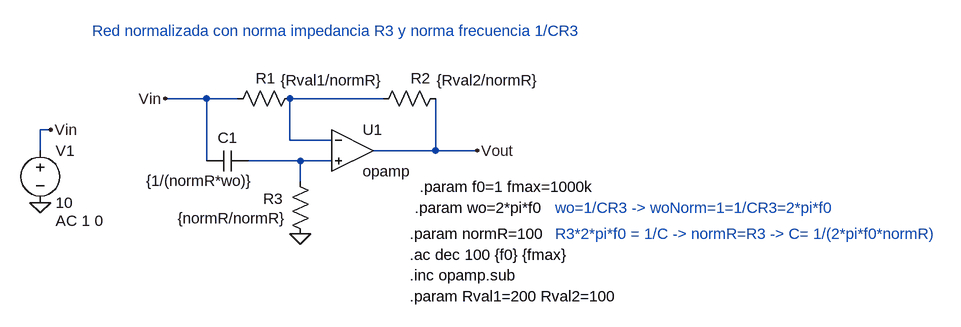
[diagram p0: schematic simulacion.asc]
simulacion.asc, the LTspice schematic file:
Version 4
SHEET 1 1152 680
WIRE 16 64 -48 64
WIRE 64 64 16 64
WIRE 288 64 144 64
WIRE -224 112 -240 112
WIRE 144 128 144 64
WIRE 208 128 144 128
WIRE -240 144 -240 112
WIRE 368 144 368 64
WIRE 368 144 272 144
WIRE 432 144 368 144
WIRE 16 160 16 64
WIRE 160 160 80 160
WIRE 208 160 160 160
WIRE 160 192 160 160
FLAG 160 272 0
FLAG -48 64 Vin
FLAG 432 144 Vout
FLAG -240 224 0
FLAG -224 112 Vin
SYMBOL OpAmps\\opamp 240 80 R0
SYMATTR InstName U1
SYMBOL res 160 48 R90
WINDOW 0 0 53 VBottom 2
WINDOW 3 -28 -49 VTop 2
SYMATTR InstName R1
SYMATTR Value {Rval1/normR}
SYMBOL res 384 48 R90
WINDOW 0 0 39 VBottom 2
WINDOW 3 -28 -65 VTop 2
SYMATTR InstName R2
SYMATTR Value {Rval2/normR}
SYMBOL res 176 288 R180
WINDOW 0 42 70 Left 2
WINDOW 3 36 40 Left 2
SYMATTR InstName R3
SYMATTR Value {normR/normR}
SYMBOL cap 80 144 R90
WINDOW 0 -4 32 VBottom 2
WINDOW 3 31 74 VTop 2
SYMATTR InstName C1
SYMATTR Value {1/(normR*wo)}
SYMBOL voltage -240 128 R0
WINDOW 123 24 124 Left 2
WINDOW 39 0 0 Left 0
SYMATTR InstName V1
SYMATTR Value 10
SYMATTR Value2 AC 1 0
TEXT -160 -40 Left 2 ;Red normalizada con norma impedancia R3 y norma frecuencia 1/CR3
TEXT 328 272 Left 2 !.param normR=100
TEXT 328 304 Left 2 !.ac dec 100 {f0} {fmax}
TEXT 328 336 Left 2 !.inc opamp.sub
TEXT 336 232 Left 2 !.param wo=2*pi*f0
TEXT 552 232 Left 2 ;wo=1/CR3 -> woNorm=1=1/CR3=2*pi*f0
TEXT 552 272 Left 2 ;R3*2*pi*f0 = 1/C -> normR=R3 -> C= 1/(2*pi*f0*normR)
TEXT 344 200 Left 2 !.param f0=1 fmax=1000k
TEXT 328 368 Left 2 !.param Rval1=200 Rval2=100

The netlist it stands for:
* simulacion.asc
XU1 N001 N002 Vout opamp Aol=100K GBW=10Meg  ; pins invin noninvin out
R1 N001 Vin {Rval1/normR}
R2 Vout N001 {Rval2/normR}
R3 0 N002 {normR/normR}
C1 N002 Vin {1/(normR*wo)}
V1 Vin 0 10 AC 1 0
* Red normalizada con norma impedancia R3 y norma frecuencia 1/CR3
.param normR=100
.ac dec 100 {f0} {fmax}
.inc opamp.sub
.param wo=2*pi*f0
* wo=1/CR3 -> woNorm=1=1/CR3=2*pi*f0
* R3*2*pi*f0 = 1/C -> normR=R3 -> C= 1/(2*pi*f0*normR)
.param f0=1 fmax=1000k
.param Rval1=200 Rval2=100
.backanno
.end